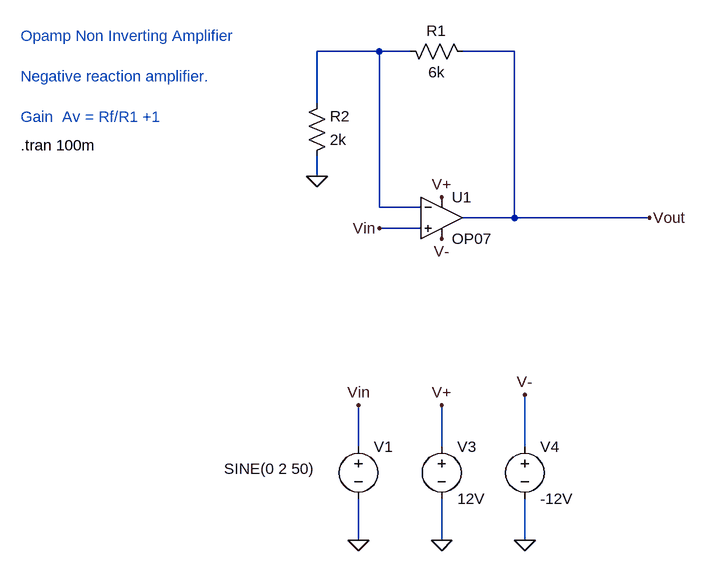
[diagram p0: schematic opamp_non_inverting_amplifier.asc]
opamp_non_inverting_amplifier.asc, the LTspice schematic file:
Version 4
SHEET 1 880 680
WIRE 64 -416 -32 -416
WIRE 112 -416 64 -416
WIRE 272 -416 192 -416
WIRE -32 -336 -32 -416
WIRE -32 -224 -32 -256
WIRE 64 -176 64 -416
WIRE 128 -176 64 -176
WIRE 272 -160 272 -416
WIRE 272 -160 192 -160
WIRE 480 -160 272 -160
WIRE 128 -144 64 -144
WIRE 32 192 32 128
WIRE 160 192 160 128
WIRE 288 192 288 112
WIRE 32 336 32 272
WIRE 160 336 160 272
WIRE 288 336 288 272
FLAG 32 336 0
FLAG 160 336 0
FLAG 288 336 0
FLAG 160 128 V+
FLAG 288 112 V-
FLAG 160 -192 V+
FLAG 32 128 Vin
FLAG 160 -128 V-
FLAG 480 -160 Vout
FLAG 64 -144 Vin
FLAG -32 -224 0
SYMBOL voltage 32 176 R0
WINDOW 123 0 0 Left 0
WINDOW 39 0 0 Left 0
WINDOW 3 -207 50 Left 2
SYMATTR InstName V1
SYMATTR Value SINE(0 2 50)
SYMBOL OpAmps\\OP07 160 -224 R0
SYMATTR InstName U1
SYMBOL voltage 160 176 R0
WINDOW 123 0 0 Left 0
WINDOW 39 0 0 Left 0
SYMATTR InstName V3
SYMATTR Value 12V
SYMBOL voltage 288 176 R0
WINDOW 123 0 0 Left 0
WINDOW 39 0 0 Left 0
SYMATTR InstName V4
SYMATTR Value -12V
SYMBOL res 96 -432 M90
WINDOW 0 0 56 VBottom 2
WINDOW 3 32 56 VTop 2
SYMATTR InstName R1
SYMATTR Value 6k
SYMBOL res -48 -240 M180
WINDOW 0 36 76 Left 2
WINDOW 3 36 40 Left 2
SYMATTR InstName R2
SYMATTR Value 2k
TEXT -488 -272 Left 2 !.tran 100m
TEXT -488 -440 Left 2 ;Opamp Non Inverting Amplifier\n \nNegative reaction amplifier.\n \nGain  Av = Rf/R1 +1

The netlist it stands for:
* opamp_non_inverting_amplifier.asc
V1 Vin 0 SINE(0 2 50)
XU1 Vin N001 V+ V- Vout LT1001  ; OP07, pins In+ In- V+ V- OUT
V3 V+ 0 12V
V4 V- 0 -12V
R1 N001 Vout 6k
R2 0 N001 2k
.tran 100m
* Opamp Non Inverting Amplifier
* Negative reaction amplifier.
* Gain  Av = Rf/R1 +1
.lib LTC.lib
.backanno
.end